# EAGLE design SNES_Basic (EAGLE 6.5.0)
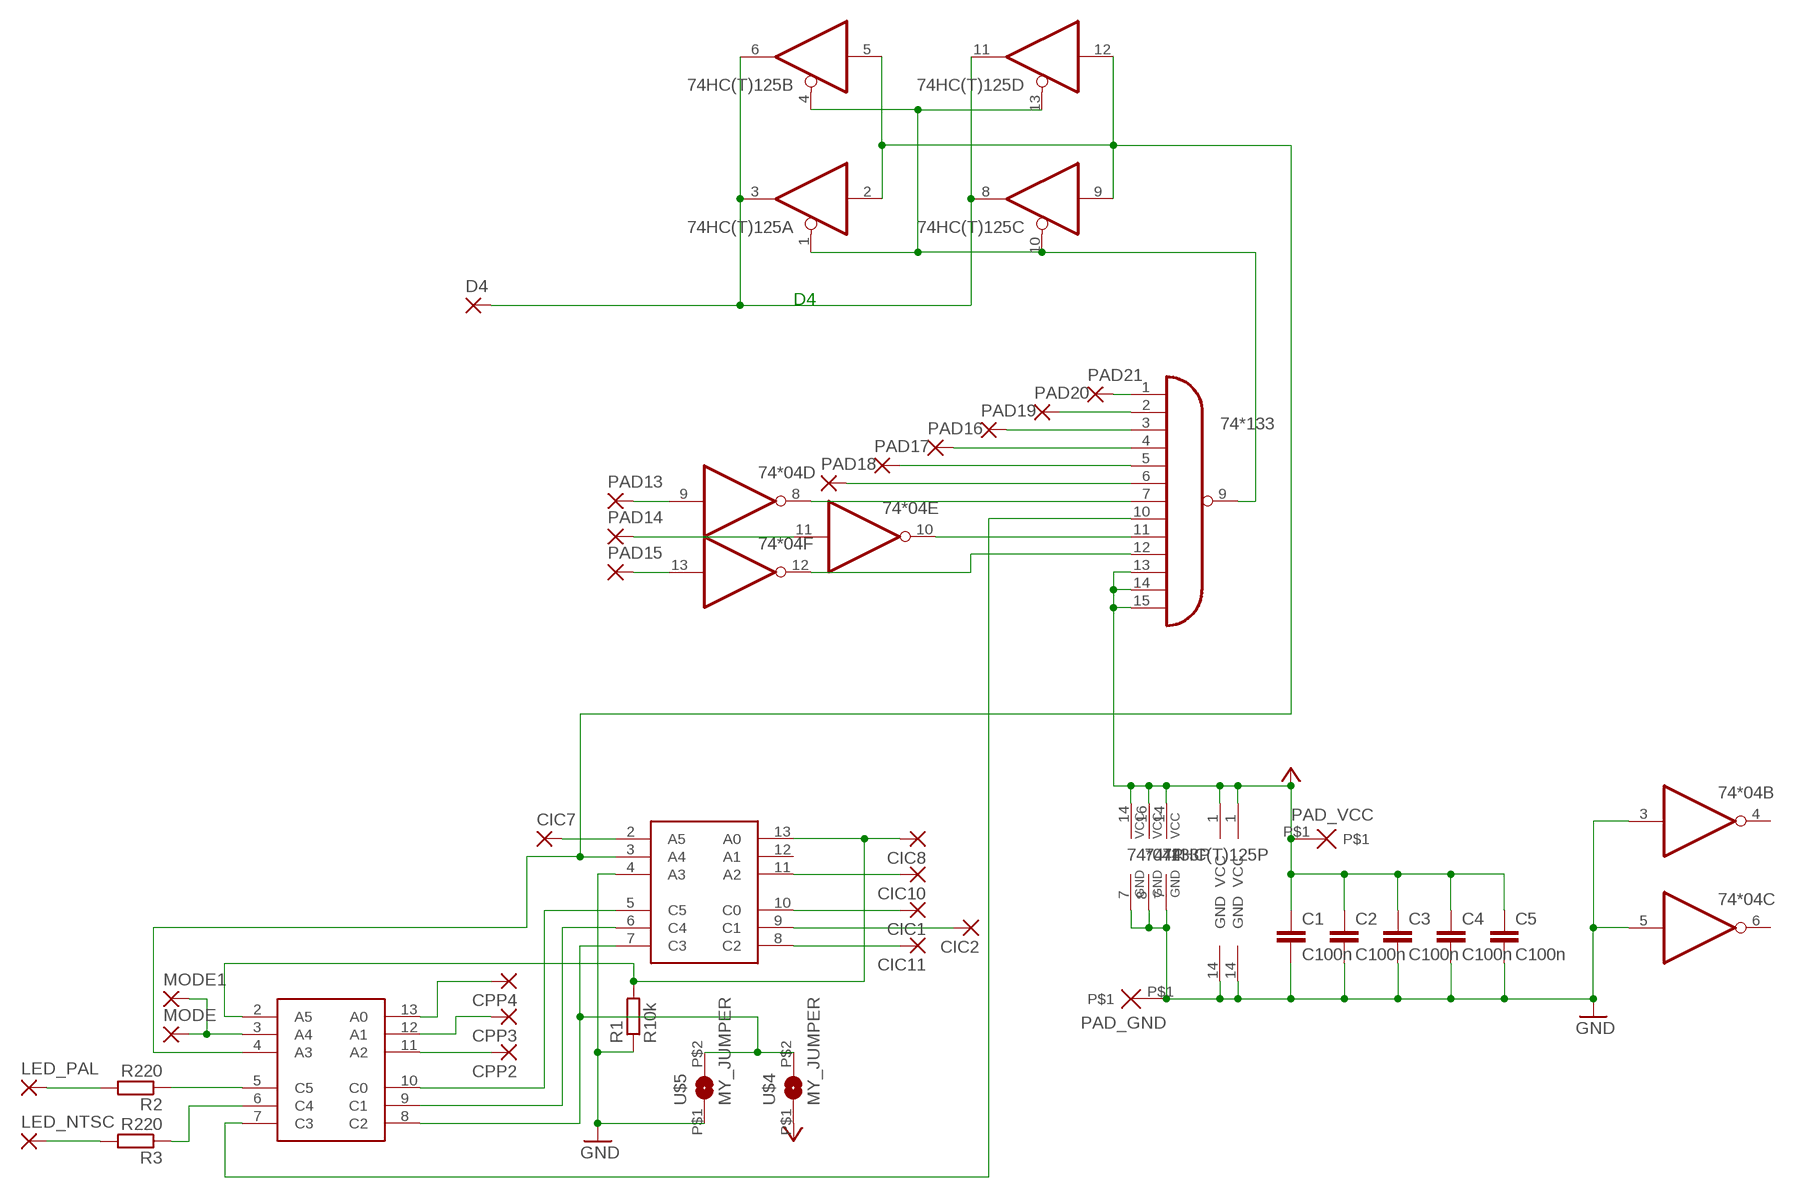
[diagram p0: schematic, sheet 1]

## Parts
74*04  74S04D  [SO14]
74*133  74S133D  [SO16]
74HC(T)125  74HCT125D  [SO14]
C1  C100n  C0805  [Z0805]
C2  C100n  C0805  [Z0805]
C3  C100n  C0805  [Z0805]
C4  C100n  C0805  [Z0805]
C5  C100n  C0805  [Z0805]
CIC1  SMD2  [SMD1,27-2,54]
CIC2  SMD2  [SMD1,27-2,54]
CIC7  SMD2  [SMD1,27-2,54]
CIC8  SMD2  [SMD1,27-2,54]
CIC10  SMD2  [SMD1,27-2,54]
CIC11  SMD2  [SMD1,27-2,54]
CPP2  SMD2  [SMD1,27-2,54]
CPP3  SMD2  [SMD1,27-2,54]
CPP4  SMD2  [SMD1,27-2,54]
D4  SMD2  [SMD1,27-2,54]
LED_NTSC  SMD2  [SMD1,27-2,54]
LED_PAL  SMD2  [SMD1,27-2,54]
MODE  SMD2  [SMD1,27-2,54]
MODE1  SMD2  [SMD1,27-2,54]
PAD13  SMD2  [SMD1,27-2,54]
PAD14  SMD2  [SMD1,27-2,54]
PAD15  SMD2  [SMD1,27-2,54]
PAD16  SMD2  [SMD1,27-2,54]
PAD17  SMD2  [SMD1,27-2,54]
PAD18  SMD2  [SMD1,27-2,54]
PAD19  SMD2  [SMD1,27-2,54]
PAD20  SMD2  [SMD1,27-2,54]
PAD21  SMD2  [SMD1,27-2,54]
PAD_GND  PAD  [PADS]
PAD_VCC  PAD  [PADS]
R1  R10k  R0805  [Z0805]
R2  R220  R0805  [Z0805]
R3  R220  R0805  [Z0805]
U$2  PIC16F630_SIMPLE  [PIC16F630]
U$3  PIC16F630_SIMPLE  [PIC16F630]
U$4  MY_JUMPER  [MYJUMP]
U$5  MY_JUMPER  [MYJUMP]

## Nets
D4_ON/OFF: 74*133.10(I7) U$3.7(C3)
GND: 74*04.3(B:I) 74*04.5(C:I) 74*04.7(P:GND) 74*133.8(GND) 74HC(T)125.7(P:GND) C1.2 C2.2 C3.2 C4.2 C5.2 PAD_GND.P$1 R1.1 U$2.4(A3) U$2.14(GND) U$3.14(GND) U$5.P$1
N$1: LED_PAL.1(P) R2.2
N$2: 74*133.9(O) 74HC(T)125.1(A:OE) 74HC(T)125.4(B:OE) 74HC(T)125.10(C:OE) 74HC(T)125.13(D:OE)
N$3: CIC10.1(P) U$2.11(A2)
N$4: 74*133.5(I4) PAD17.1(P)
N$5: 74*133.4(I3) PAD16.1(P)
N$6: 74*133.3(I2) PAD19.1(P)
N$7: 74*133.2(I1) PAD20.1(P)
N$8: 74*133.1(I0) PAD21.1(P)
N$9: CIC7.1(P) U$2.2(A5)
N$10: CIC8.1(P) R1.2 U$2.13(A0) U$3.2(A5)
N$11: 74*04.9(D:I) PAD13.1(P)
N$12: R2.1 U$3.5(C5)
N$13: R3.1 U$3.6(C4)
N$14: LED_NTSC.1(P) R3.2
N$15: 74*133.6(I5) PAD18.1(P)
N$16: 74*04.8(D:O) 74*133.7(I6)
N$17: 74*04.10(E:O) 74*133.11(I8)
N$18: 74*04.13(F:I) PAD15.1(P)
N$19: U$2.5(C5) U$3.10(C0)
N$20: 74*04.12(F:O) 74*133.12(I9)
N$22: 74*04.11(E:I) PAD14.1(P)
N$33: CPP2.1(P) U$3.11(A2)
N$34: CPP3.1(P) U$3.12(A1)
N$42: 74HC(T)125.3(A:O) 74HC(T)125.6(B:O) 74HC(T)125.8(C:O) 74HC(T)125.11(D:O) D4.1(P)
N$46: CPP4.1(P) U$3.13(A0)
N$48: CIC1.1(P) U$2.10(C0)
N$49: CIC2.1(P) U$2.9(C1)
N$51: CIC11.1(P) U$2.8(C2)
N$52: U$2.6(C4) U$3.9(C1)
N$53: U$2.7(C3) U$3.8(C2) U$4.P$2 U$5.P$2
N$56: MODE1.1(P) MODE.1(P) U$3.3(A4)
UIGR: 74HC(T)125.2(A:I) 74HC(T)125.5(B:I) 74HC(T)125.9(C:I) 74HC(T)125.12(D:I) U$2.3(A4) U$3.4(A3)
VCC: 74*04.14(P:VCC) 74*133.13(I10) 74*133.14(I11) 74*133.15(I12) 74*133.16(VCC) 74HC(T)125.14(P:VCC) C1.1 C2.1 C3.1 C4.1 C5.1 PAD_VCC.P$1 U$2.1(VCC) U$3.1(VCC) U$4.P$1
Unconnected: 74*04.1(A:I) 74*04.2(A:O) 74*04.4(B:O) 74*04.6(C:O) U$2.12(A1)

## Notes on the sheet
- D4

## Library data of the parts
74*04 = 74xx-eu:74*04: Hex INVERTER
74*133 = 74xx-eu:74*133: 13-input NAND gate
74HC(T)125 = 74xx-eu:74*125: Quad bus BUFFER, 3-state
C1-C5 = snescart:C0805
CIC1 CIC2 CIC7 CIC8 CIC10 CIC11 CPP2-CPP4 D4 LED_NTSC LED_PAL MODE MODE1 PAD13-PAD21 = wirepad:SMD2: SMD PAD
PAD_GND PAD_VCC = snescart:PAD
R1-R3 = snescart:R0805
U$2 U$3 = snescart:PIC16F630_SIMPLE
U$4 U$5 = snescart:MY_JUMPER

## Board
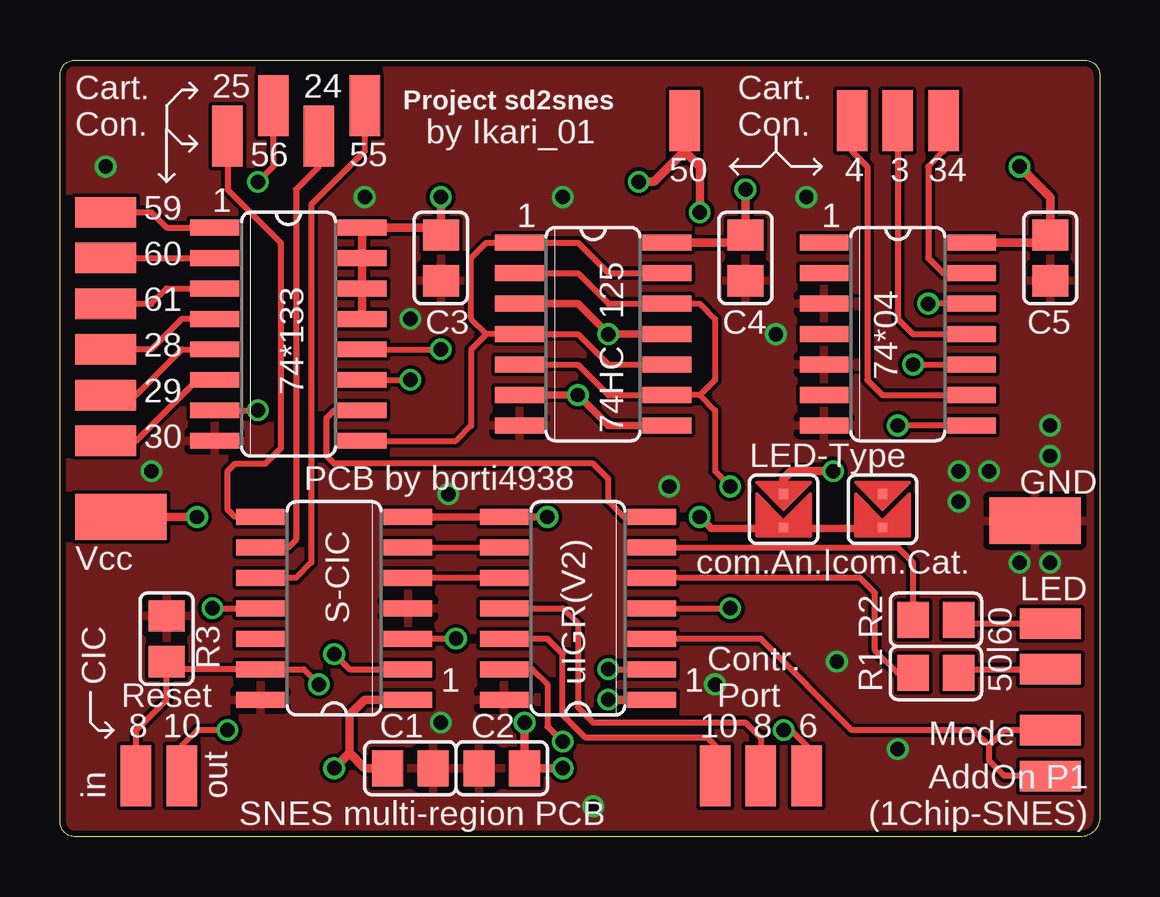
[diagram p1: board, top side]
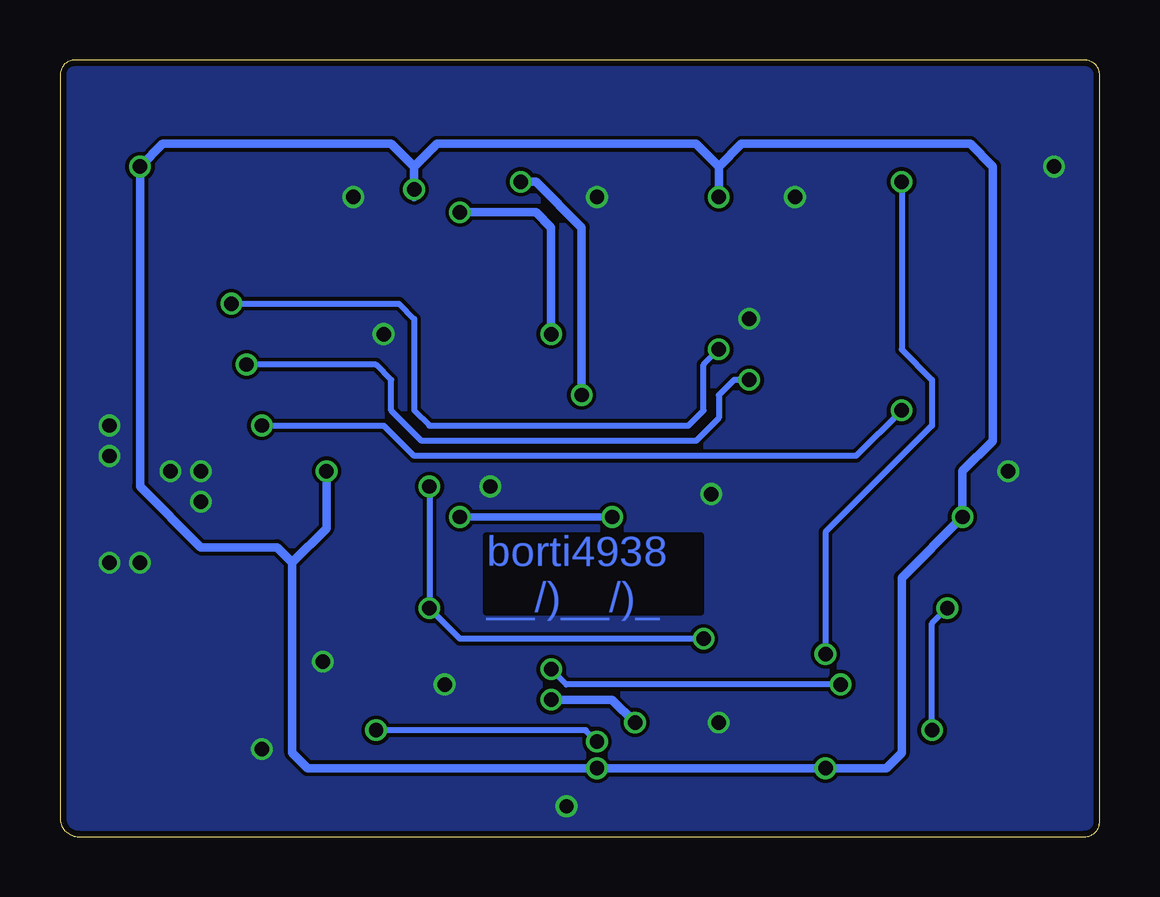
[diagram p2: board, bottom side, seen from below]

Size 43.34 x 32.38 mm. Coordinates in mm from the lower left corner, seen from the top.
Outline: 0.64,32.38 42.7,32.38 arc-90 43.34,31.75 43.34,0.79 arc-90 42.55,0 0.64,0 arc-90 0,0.64 0,31.75 arc-90 0.64,32.38
Copper layers (1*16): Top 0.035mm / dielectric 1.5mm / Bottom 0.035mm
Design rules "ITEADstudio_DRC": minimum track width 6mil, minimum drill 12mil, track to track 6mil, track to pad 6mil, pad to pad 6mil, via to via 6mil, smd to smd 0mil, copper to edge 10mil, drill to drill 10mil, minimum pad ring 10mil, minimum via ring 6mil, stop-mask expansion 2mil, vias tented up to drill 100mil, thermal gap 10mil

### Footprints (pad centres in the part's own frame; a part is rotated, then mirrored left to right if it is on the bottom)
SO14 = smd 0.66 x 2.032: 1 -3.81,-3.073; 2 -2.54,-3.073; 3 -1.27,-3.073; 4 0,-3.073; 5 1.27,-3.073; 6 2.54,-3.073; 7 3.81,-3.073; 8 3.81,3.073; 9 2.54,3.073; 10 1.27,3.073; 11 0,3.073; 12 -1.27,3.073; 13 -2.54,3.073; 14 -3.81,3.073
SO16 = smd 0.66 x 2.032: 1 -4.445,-3.073; 2 -3.175,-3.073; 3 -1.905,-3.073; 4 -0.635,-3.073; 5 0.635,-3.073; 6 1.905,-3.073; 7 3.175,-3.073; 8 4.445,-3.073; 9 4.445,3.073; 10 3.175,3.073; 11 1.905,3.073; 12 0.635,3.073; 13 -0.635,3.073; 14 -1.905,3.073; 15 -3.175,3.073; 16 -4.445,3.073
Z0805 = smd 1.3 x 1.5: 1 -0.95,0; 2 0.95,0
SMD1,27-2,54 = smd 1.27 x 2.54: 1 0,0
PADS = smd 1.93 x 3.81: P$1 0,0
PIC16F630 = smd 0.66 x 2.032: 1 -3.81,-3.073; 2 -2.54,-3.073; 3 -1.27,-3.073; 4 0,-3.073; 5 1.27,-3.073; 6 2.54,-3.073; 7 3.81,-3.073; 8 3.81,3.073; 9 2.54,3.073; 10 1.27,3.073; 11 0,3.073; 12 -1.27,3.073; 13 -2.54,3.073; 14 -3.81,3.073
MYJUMP = smd 0.406 x 0.406: P$1 -0.635,0; P$2 0.765,0

### Placement (x,y rotation side)
74*04  34.92,20.95 270 top
74*133  9.53,20.95 270 top
74HC(T)125  22.22,20.95 270 top
C1  18.41,2.86 180 top
C2  14.61,2.86 0 top
C3  28.57,24.13 270 top
C4  15.88,24.13 270 top
C5  41.27,24.13 270 top
CIC1  12.7,30.48 0 top
CIC2  10.79,29.21 0 top
CIC7  8.89,30.48 0 top
CIC8  3.17,2.54 0 top
CIC10  5.08,2.54 180 top
CIC11  6.99,29.21 0 top
CPP2  29.21,2.54 0 top
CPP3  27.3,2.54 0 top
CPP4  31.12,2.54 0 top
D4  26.04,29.84 0 top
LED_NTSC  41.27,8.89 270 top
LED_PAL  41.27,6.99 270 top
MODE  41.27,2.54 90 top
MODE1  41.27,4.45 270 top
PAD13  33.02,29.84 180 top
PAD14  34.92,29.84 180 top
PAD15  36.83,29.84 180 top
PAD16  1.91,20.32 270 top
PAD17  1.91,18.41 270 top
PAD18  1.91,16.51 270 top
PAD19  1.91,22.23 270 top
PAD20  1.91,24.13 270 top
PAD21  1.91,26.03 270 top
PAD_GND  40.64,13.18 270 top
PAD_VCC  2.54,13.33 270 top
R1  4.44,8.26 270 top
R2  36.51,6.83 0 top
R3  36.51,9.05 0 top
U$2  11.43,9.53 90 top
U$3  21.59,9.53 90 top
U$4  30.16,13.65 270 top
U$5  34.29,13.65 270 top

### Tracks (layer width: path | path; a pad name or v marks a point on that pad's centre or on a via)
D4_ON/OFF
  Top 0.254: U$3.7 23.49,13.33 22.86,13.97 22.86,14.92 22.22,15.56 11.43,15.56 11.11,15.88 11.11,17.46 11.43,17.78 74*133.10
GND  (via drill 0.6)
  other vias: 41.27,17.15 38.73,15.24 29.84,20.95 31.12,26.67 20.95,26.67 12.7,26.67 16.19,14.29 22.22,1.27 3.81,15.24 34.92,3.65 32.38,7.3 14.61,21.59 25.4,14.6 27.3,6.35 15.88,4.76 1.91,27.94 37.46,15.24 37.46,13.97 41.27,15.88 40,11.43 41.27,11.43
  pour Bottom: -1.91,34.29 47.62,34.29 47.62,-5.08 -1.91,-5.08
  pour Top: -1.91,34.29 47.62,34.29 47.62,-5.08 -1.91,-5.08
N$1
  Top 0.254: R2.2 37.46,6.99 LED_PAL.1
N$2
  Top 0.254: 74HC(T)125.13 22.86,23.49 21.59,24.77 74HC(T)125.1 17.78,24.77 17.14,24.13 17.14,21.59 17.78,20.95 | 74HC(T)125.10 22.86,19.69 21.59,20.95 74HC(T)125.4 17.78,20.95 | 74*133.9 16.51,16.51 17.14,17.15 17.14,20.32 17.78,20.95
N$3  (via drill 0.6)
  Top 0.254: v6.35,9.53 U$2.11 | v6.99,4.45 5.71,4.45 5.08,3.81 CIC10.1
  Bottom 0.254: v6.99,4.45 6.99,8.89 v6.35,9.53
N$4
  Top 0.254: PAD17.1 3.17,18.41 5.08,20.32 74*133.5
N$5
  Top 0.254: 3.17,20.32 PAD16.1 3.81,20.32 5.08,21.59 74*133.4
N$6
  Top 0.254: PAD19.1 3.81,22.23 4.44,22.86 74*133.3
N$7
  Top 0.254: PAD20.1 74*133.2
N$8
  Top 0.254: PAD21.1 3.81,26.03 4.44,25.4 74*133.1
N$9  (via drill 0.6)
  Top 0.254: v11.43,7.62 12.07,6.99 U$2.2 | CIC7.1 8.89,27.94 v8.26,27.3
  Bottom 0.254: v8.26,27.3 8.26,20.32 6.99,19.05 6.99,17.15 11.43,12.7 v11.43,7.62
N$10  (via drill 0.6)
  Top 0.254: CIC8.1 3.17,4.45 4.44,5.71 R1.2 4.76,6.99 U$2.13 10.16,6.99 v10.79,6.35 | v22.86,6.99 U$3.2
  Bottom 0.254: v10.79,6.35 22.22,6.35 v22.86,6.99
N$11
  Top 0.254: PAD13.1 33.02,28.57 33.66,27.94 33.66,19.05 34.29,18.41 74*04.9
N$12
  Top 0.254: R2.1 34.92,6.83 33.97,7.78 33.97,10.16 33.34,10.79 U$3.5
N$13
  Top 0.254: U$3.6 34.92,12.06 35.56,11.43 35.56,8.89 R3.1
N$14
  Top 0.254: R3.2 37.46,8.89 LED_NTSC.1
N$15
  Top 0.254: PAD18.1 3.17,16.51 5.71,19.05 74*133.6
N$16  (via drill 0.6)
  Top 0.254: 74*04.8 v34.92,17.15 | 74*133.7 v8.26,17.78
  Bottom 0.254: v34.92,17.15 29.84,17.15 28.57,15.88 10.16,15.88 v8.26,17.78
N$17  (via drill 0.6)
  Top 0.254: 74*133.11 v14.61,19.05 | v35.56,19.69 74*04.10
  Bottom 0.254: v14.61,19.05 15.24,19.05 15.88,18.41 15.88,17.46 16.83,16.51 28.26,16.51 29.53,17.78 29.53,19.05 30.16,19.69 v35.56,19.69
N$18
  Top 0.254: PAD15.1 36.83,28.57 36.2,27.94 36.2,24.13 36.83,23.49 74*04.13
N$19
  Top 0.254: U$3.10 U$2.5
N$20  (via drill 0.6)
  Top 0.254: 74*04.12 v36.2,22.23 | 74*133.12 v15.88,20.32
  Bottom 0.254: v36.2,22.23 29.21,22.23 28.57,21.59 28.57,17.78 27.94,17.15 17.14,17.15 16.51,17.78 16.51,19.69 v15.88,20.32
N$22
  Top 0.254: PAD14.1 34.92,21.59 35.56,20.95 74*04.11
N$33
  Top 0.254: U$3.11 20.95,9.53 21.59,8.89 21.59,5.4 22.22,4.76 28.57,4.76 29.21,4.13 CPP2.1
N$34
  Top 0.254: CPP3.1 27.3,3.81 26.99,4.13 21.91,4.13 20.95,5.08 20.95,7.62 20.32,8.26 U$3.12
N$42  (via drill 0.6)
  Top 0.305: 74HC(T)125.3 21.59,22.23 v22.86,20.95 74HC(T)125.11 | 74HC(T)125.6 v21.59,18.41 22.86,17.15 74HC(T)125.8
  Top 0.356: 26.04,28.57 D4.1 | v26.67,26.03 26.67,27.94 26.04,28.57 | v24.13,27.3 24.77,27.3 26.04,28.57
  Bottom 0.356: v21.59,18.41 21.59,25.4 23.49,27.3 v24.13,27.3 | v22.86,20.95 22.86,25.4 23.49,26.03 v26.67,26.03
N$46  (via drill 0.6)
  Top 0.254: U$3.13 19.68,6.99 20.32,6.35 20.32,4.6 v20.95,3.97 | v30.16,4.45 30.48,4.45 31.12,3.81 CPP4.1
  Bottom 0.254: v20.95,3.97 21.43,4.45 v30.16,4.45
N$48
  Top 0.254: CIC1.1 12.7,28.57 10.48,26.35 10.48,11.43 9.84,10.79 U$2.10
N$49
  Top 0.254: CIC2.1 10.79,27.94 9.84,26.99 9.84,12.38 9.53,12.06 U$2.9
N$51
  Top 0.254: U$2.8 7.3,13.33 6.99,13.65 6.99,15.24 7.3,15.56 8.57,15.56 9.21,16.19 9.21,24.77 6.99,26.99 CIC11.1
N$52
  Top 0.254: U$2.6 U$3.9
N$53  (via drill 0.6)
  Top 0.305: U$2.7 U$3.8 v20.32,13.33 | v26.67,13.33 27.15,12.86 30.16,12.86 | 30.16,12.86 34.26,12.86 U$5.P$2 | U$4.P$2 30.16,12.86
  Bottom 0.305: v20.32,13.33 v26.67,13.33
N$56
  Top 0.254: MODE.1 39.37,2.54 38.73,3.18 38.73,3.81 | U$3.3 29.21,8.26 33.02,4.45 38.1,4.45 38.73,3.81 | MODE1.1 39.37,4.45 38.73,3.81
UIGR  (via drill 0.6)
  Top 0.254: 74HC(T)125.5 21.59,19.69 22.86,18.41 74HC(T)125.9 26.67,18.41 | 74HC(T)125.2 21.59,23.49 22.86,22.23 74HC(T)125.12 26.67,22.23 27.3,21.59 27.3,19.05 26.67,18.41 | 26.67,18.41 27.3,17.78 27.3,15.24 v27.94,14.6 | v16.51,8.26 U$2.3 | U$3.4 v27.94,9.53
  Bottom 0.254: v27.94,14.6 v27.94,9.53 26.67,8.26 v16.51,8.26
VCC  (via drill 0.6)
  Top 0.356: v28.57,26.99 C3.1 28.26,24.77 74HC(T)125.14 | 74*04.14 40.96,24.77 C5.1 41.27,26.67 v40,27.94 | v22.86,5.71 U$3.1 | U$2.1 12.7,5.71 12.07,5.08 12.07,3.49 | 12.07,3.49 12.7,2.86 C2.1 | PAD_VCC.P$1 v5.71,13.33 | 74*133.13 74*133.14 74*133.15 74*133.16 15.56,25.4 C4.1 | v11.43,2.86 12.07,3.49 | v19.37,4.76 C1.1 | C1.1 | C1.1 v20.95,2.86 | C4.1 16.19,25.08 | v15.88,26.67 C4.1 | v32.23,15.24 30.48,15.24 30.16,14.92 U$4.P$1
  Bottom 0.356: v15.88,26.67 15.88,27.94 | 33.66,11.43 34.29,12.06 37.46,12.06 40,14.6 v40,27.94 39.05,28.89 29.53,28.89 28.57,27.94 | v32.23,15.24 32.23,12.86 33.66,11.43 | v22.86,5.71 20.32,5.71 v19.37,4.76 | 15.88,27.94 14.92,28.89 5.4,28.89 4.44,27.94 4.44,16.51 5.71,15.24 v5.71,13.33 8.26,10.79 8.26,3.49 8.89,2.86 v11.43,2.86 v20.95,2.86 33.02,2.86 33.66,3.49 33.66,11.43 | 15.88,27.94 16.83,28.89 27.62,28.89 28.57,27.94 | 28.57,27.94 v28.57,26.99 28.57,26.67

### Text on the board
Bottom: borti4938 / __/)__/)_
tNames: 25 | 24 | Project sd2snes | Cart. / Con. | Cart. / Con. | by Ikari_01 | 56 | 55 | 50 | 4 | 3 | 34 | 59 | 1 | 1 | 1 | 60 | 61 | 125 | C3 | C4 | C5 | 28 | 74*133 | 74*04 | 29 | 30 | 74HC | LED-Type | PCB by borti4938 | GND | Vcc | com.An.|com.Cat. | LED | S-CIC | R2 | CIC | R3 | uIGR(V2) | Reset | 1 | 1 | Contr. / Port | R1 | 50|60 | 8 | 10 | C1 | C2 | 10 | 8 | 6 | Mode | AddOn P1 / (1Chip-SNES) | in | out | SNES multi-region PCB